# EAGLE design ldb (EAGLE 8.2.2)
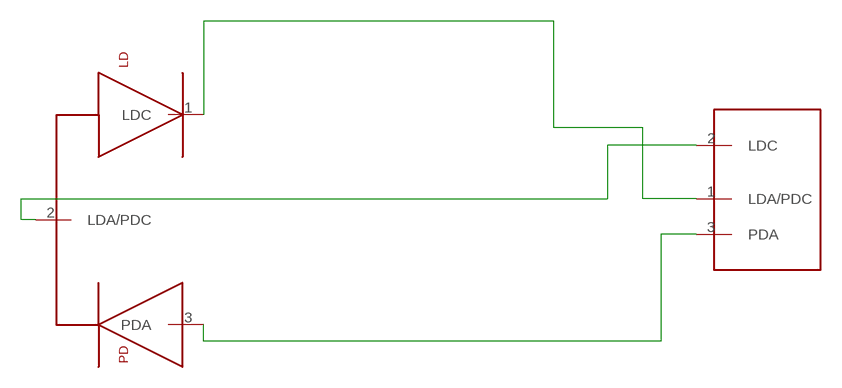
[diagram p0: schematic, sheet 1]

## Parts
U$1  635LDDEV  [635LD]
U$2  SAMTECH3PIN  [SAMTEC7PIN]

## Nets
N$1: U$1.1(LDC) U$2.1(LDA/PDC)
N$2: U$1.2(LDA/PDC) U$2.2(LDC)
N$3: U$1.3(PDA) U$2.3(PDA)

## Library data of the parts
U$1 = ldb:635LDDEV: 635NM LASER DIODE
U$2 = ldb:SAMTECH3PIN

## Net classes
0 default: width 0.152 mm, drill 0.3 mm, clearance 0.152 mm

## Board
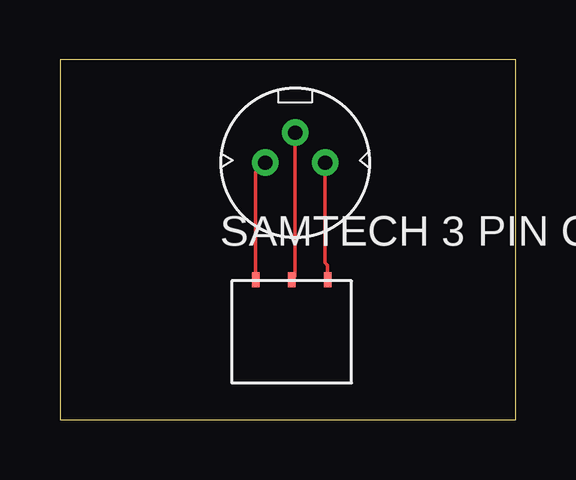
[diagram p1: board, top side]

Size 19 x 14.98 mm. Coordinates in mm from the lower left corner, seen from the top.
Outline: 0,0 19,0 19,14.98 0,14.98 0,0
Copper layers (1*16): Top 0.035mm / dielectric 1.5mm / Bottom 0.035mm
Design rules "default": minimum track width 6mil, minimum drill 0.35mm, track to track 6mil, track to pad 6mil, pad to pad 6mil, via to via 6mil, smd to smd 6mil, copper to edge 40mil, drill to drill 6mil, minimum pad ring 10mil, minimum via ring 8mil, stop-mask expansion 4mil, vias tented up to drill 0mil, thermal gap 10mil

### Footprints (pad centres in the part's own frame; a part is rotated, then mirrored left to right if it is on the bottom)
635LD = drill 0.6: 1 0,-1.25; 2 -1.25,0; 3 0,1.25
SAMTEC7PIN = smd 0.305 x 0.61: 1 1,4.3; 2 2.5,4.3; 3 4,4.3

### Placement (x,y rotation side)
U$1  9.81,10.7 270 top
U$2  7.16,1.52 0 top

### Tracks (layer width: path | path; a pad name or v marks a point on that pad's centre or on a via)
N$1
  Top 0.152: U$2.1 8.16,10.3 U$1.1
N$2
  Top 0.152: U$1.2 9.81,5.97 U$2.2
N$3
  Top 0.152: U$1.3 11.06,6.54 11.16,6.44 U$2.3